# EAGLE board SparkFun_Robo_HAT (EAGLE 9.5.2)
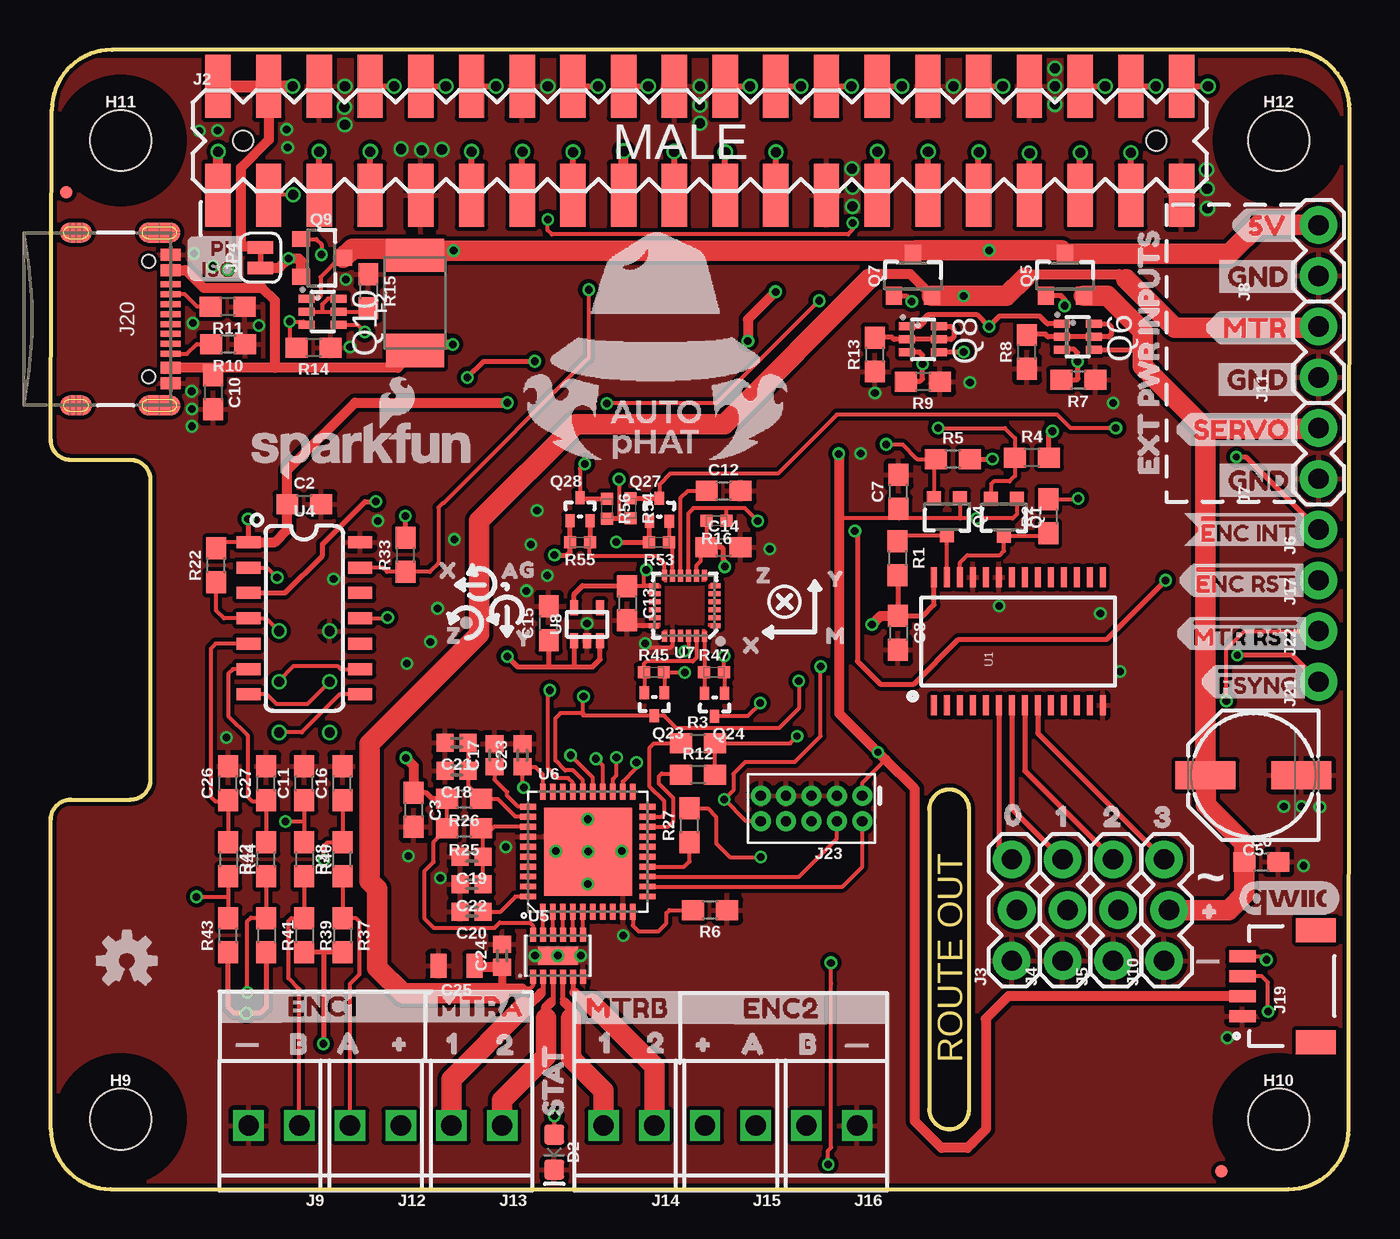
[diagram p3: board, top side]
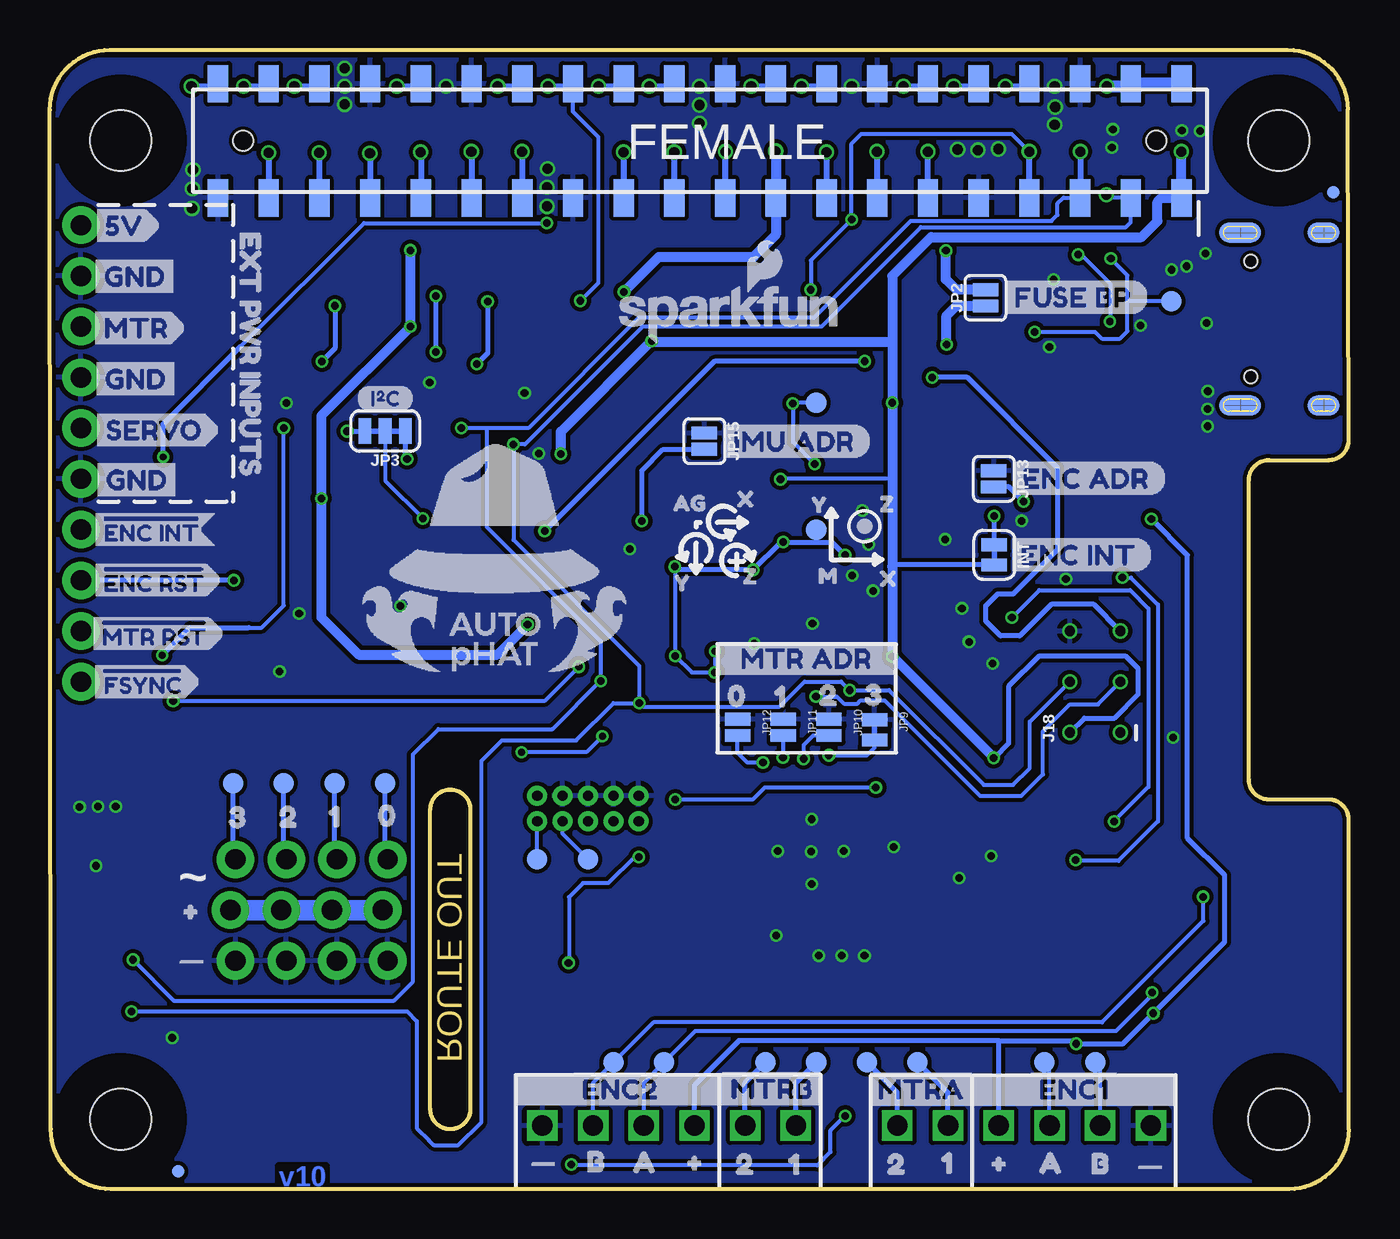
[diagram p4: board, bottom side, seen from below]

Size 65.05 x 57.03 mm. Coordinates in mm from the lower left corner, seen from the top.
Outline: 3,0 62,0 arc90 65,3 65.05,54.03 arc90 62.05,57.03 3.05,57.03 arc90 0.05,54.03 0,37.5 arc90 1,36.5 4,36.5 arc-90 5,35.5 5,20.5 arc-90 4,19.5 1,19.5 arc90 0,18.5 0,3 arc90 3,0
Outline: 45,3 arc90 46,4 46,19 arc90 45,20 arc90 44,19 44,4 arc90 45,3
Copper layers (1*16): Top 0.035mm / dielectric 1.5mm / Bottom 0.035mm
Design rules "SparkFun-2-layer-FAB-LIMIT": minimum track width 4mil, minimum drill 6mil, track to track 4mil, track to pad 4mil, pad to pad 4mil, via to via 4mil, smd to smd 4mil, copper to edge 4mil, drill to drill 4mil, minimum pad ring 5mil, minimum via ring 5mil, stop-mask expansion 4mil, vias tented up to drill 25mil, thermal gap 10mil
Net classes: 1 power: width 0.508 mm
tRestrict: area 29.3,16.8 to 29.4,16.9; area 26.8,19.3 to 27,19.4; area 24.4,16.8 to 24.5,17; area 26.8,14.4 to 27,14.5; area 0.4,0.4 to 6.6,6.6; area 0.4,49.4 to 6.6,55.6; area 58.4,0.4 to 64.6,6.6; area 58.4,49.4 to 64.6,55.6
bRestrict: area 0.4,0.4 to 6.6,6.6; area 0.4,49.4 to 6.6,55.6; area 58.4,0.4 to 64.6,6.6; area 58.4,49.4 to 64.6,55.6

## Footprints (pad centres in the part's own frame; a part is rotated, then mirrored left to right if it is on the bottom)
0603 = smd 1.1 x 1: 1 -0.85,0; 2 0.85,0
PANASONIC_D = smd 3 x 1.4: + 2.4,0; - -2.4,0
0402 = smd 0.85 x 0.9: 1 -0.58,0; 2 0.58,0
0805 = smd 0.8 x 1.2: 1 -0.9,0; 2 0.9,0
LED-0603@1 = smd 1 x 1: A -0.877,0; C 0.877,0
1812 = smd 1.676 x 2.896: 1 -2.388,0; 2 2.388,0
FIDUCIAL-MICRO = smd 0.635 x 0.635: 1 0,0
STAND-OFF-TIGHT = hole 3.048: 0,0
SMT-JUMPER_2_NC_TRACE_SILK = smd 0.635 x 1.27: 1 -0.508,0; 2 0.508,0
RASPBERRY_PI_HAT_40_PIN_SMD_STACKABLE_NOHOLES = smd 1.27 x 3.175: 1 0,-1.46; 2 0,4; 3 2.54,-1.46; 4 2.54,4; 5 5.08,-1.46; 6 5.08,4; 7 7.62,-1.46; 8 7.62,4; 9 10.16,-1.46; 10 10.16,4; 11 12.7,-1.46; 12 12.7,4; 13 15.24,-1.46; 14 15.24,4; 15 17.78,-1.46; 16 17.78,4; 17 20.32,-1.46; 18 20.32,4; 19 22.86,-1.46; 20 22.86,4; 21 25.4,-1.46; 22 25.4,4; 23 27.94,-1.46; 24 27.94,4; 25 30.48,-1.46; 26 30.48,4; 27 33.02,-1.46; 28 33.02,4; 29 35.56,-1.46; 30 35.56,4; 31 38.1,-1.46; 32 38.1,4; 33 40.64,-1.46; 34 40.64,4; 35 43.18,-1.46; 36 43.18,4; 37 45.72,-1.46; 38 45.72,4; 39 48.26,-1.46; 40 48.26,4 | smd 1.02 x 1.87 bottom: 1B 0,-1.587; 2B 0,4.128; 3B 2.54,-1.587; 4B 2.54,4.128; 5B 5.08,-1.587; 6B 5.08,4.128; 7B 7.62,-1.587; 8B 7.62,4.128; 9B 10.16,-1.587; 10B 10.16,4.128; 11B 12.7,-1.587; 12B 12.7,4.128; 13B 15.24,-1.587; 14B 15.24,4.128; 15B 17.78,-1.587; 16B 17.78,4.128; 17B 20.32,-1.587; 18B 20.32,4.128; 19B 22.86,-1.587; 20B 22.86,4.128; 21B 25.4,-1.587; 22B 25.4,4.128; 23B 27.94,-1.587; 24B 27.94,4.128; 25B 30.48,-1.587; 26B 30.48,4.128; 27B 33.02,-1.587; 28B 33.02,4.128; 29B 35.56,-1.587; 30B 35.56,4.128; 31B 38.1,-1.587; 32B 38.1,4.128; 33B 40.64,-1.587; 34B 40.64,4.128; 35B 43.18,-1.587; 36B 43.18,4.128; 37B 45.72,-1.587; 38B 45.72,4.128; 39B 48.26,-1.587; 40B 48.26,4.128 | hole 1: 1.27,1.27; 46.99,1.27
1X03_LOCK = drill 1.016 pad 1.88: 1 0,0.127; 2 2.54,-0.127; 3 5.08,0.127
1X01_NO_SILK = drill 1.016 pad 1.88: 1 0,0
1X02 = drill 1.016 pad 1.88: 1 0,0; 2 2.54,0
1X02_2.54_SCREWTERM = drill 1.016 square: P1 2.54,0; P2 0,0
2X3_TEST_POINTS = drill 0.508: 1 -2.54,-1.27; 2 -2.54,1.27; 3 0,-1.27; 4 0,1.27; 5 2.54,-1.27; 6 2.54,1.27
JST04_1MM_RA = smd 0.6 x 1.35: 1 -1.5,0; 2 -0.5,0; 3 0.5,0; 4 1.5,0 | smd 1.2 x 2: NC1 2.8,-3.675; NC2 -2.8,-3.675
USB-C-16P = smd 0.3 x 1: A5 -1.25,-0.34; A6 -0.25,-0.34; A7 0.25,-0.34; A8 1.25,-0.34; B5 1.75,-0.34; B6 0.75,-0.34; B7 -0.75,-0.34; B8 -1.75,-0.34 | smd 0.6 x 1: GND -3.225,-0.34; GND2 3.225,-0.34; VBUS1 -2.45,-0.34; VBUS2 2.45,-0.34 | smd 1 x 2.1: SHLD1 -4.32,-0.915; SHLD2 4.32,-0.915 | smd 1 x 2.1 bottom: SHLD3 -4.32,-0.915; SHLD4 4.32,-0.915 | smd 1 x 1.6: SHLD5 -4.32,-5.095; SHLD8 4.32,-5.095 | smd 1 x 1.6 bottom: SHLD6 -4.32,-5.095; SHLD7 4.32,-5.095 | hole 0.65: -2.89,-1.445; 2.89,-1.445
2X5-PTH-1.27MM = drill 0.508 pad 1: 1 -2.54,-0.635; 2 -2.54,0.635; 3 -1.27,-0.635; 4 -1.27,0.635; 5 0,-0.635; 6 0,0.635; 7 1.27,-0.635; 8 1.27,0.635; 9 2.54,-0.635; 10 2.54,0.635
SMT-JUMPER_2_NO_SILK = smd 0.635 x 1.27: 1 -0.406,0; 2 0.406,0
SMT-JUMPER_3_2-NC_TRACE_SILK = smd 0.635 x 1.27: 1 -1.016,0; 2 0,0; 3 1.016,0
SMT-JUMPER_2_NC_TRACE_NO-SILK = smd 0.635 x 1.27: 1 -0.508,0; 2 0.508,0
SMT-JUMPER_2_NO_NO-SILK = smd 0.635 x 1.27: 1 -0.406,0; 2 0.406,0
SOT323 = smd 0.7 x 0.7: 1 -0.65,-0.925; 2 0.65,-0.925; 3 0,0.925
SOT23-3 = smd 0.8 x 0.9: 1 -0.95,-1; 2 0.95,-1; 3 0,1.1
SOT363_PHILIPS = smd 0.4 x 0.8: 1 -0.65,-0.8; 2 0,-0.8; 3 0.65,-0.8; 4 0.65,0.8; 5 0,0.8; 6 -0.65,0.8
SOT-416FL = smd 0.46 x 0.65: 1 -0.5,-1.1; 2 0.5,-1.1; 3 0,0.05
0603@1 = smd 1.1 x 1: 1 -0.85,0; 2 0.85,0
0402-TIGHT = smd 0.6 x 0.6: 1 -0.5,0; 2 0.5,0
PAD.03X.04 = smd 1.016 x 1.016: P$1 0,0
TP_15TH = drill 0.381 pad 0.61: P$1 0,0
TSSOP-28_4MM = smd 1 x 0.3: 1 -3.2,4.225; 2 -3.2,3.575; 3 -3.2,2.925; 4 -3.2,2.275; 5 -3.2,1.625; 6 -3.2,0.975; 7 -3.2,0.325; 8 -3.2,-0.325; 9 -3.2,-0.975; 10 -3.2,-1.625; 11 -3.2,-2.275; 12 -3.2,-2.925; 13 -3.2,-3.575; 14 -3.2,-4.225; 15 3.2,-4.225; 16 3.2,-3.575; 17 3.2,-2.925; 18 3.2,-2.275; 19 3.2,-1.625; 20 3.2,-0.975; 21 3.2,-0.325; 22 3.2,0.325; 23 3.2,0.975; 24 3.2,1.625; 25 3.2,2.275; 26 3.2,2.925; 27 3.2,3.575; 28 3.2,4.225
SO14 = smd 0.6 x 1.2: 1 -3.175,-2.8; 2 -1.905,-2.8; 3 -0.635,-2.8; 4 0.635,-2.8; 5 1.905,-2.8; 6 3.175,-2.8; 7 4.445,-2.8; 8 4.445,2.8; 9 3.175,2.8; 10 1.905,2.8; 11 0.635,2.8; 12 -0.635,2.8; 13 -1.905,2.8; 14 -3.175,2.8
WSON-12 = smd 0.3 x 0.7: 1 -1.25,-1.05; 2 -0.75,-1.05; 3 -0.25,-1.05; 4 0.25,-1.05; 5 0.75,-1.05; 6 1.25,-1.05; 7 1.25,1.05; 8 0.75,1.05; 9 0.25,1.05; 10 -0.25,1.05; 11 -0.75,1.05; 12 -1.25,1.05 | smd 2 x 0.9: PAD 0,0
QFN-40 = smd 0.285 x 0.8: 1 -2.25,-3; 2 -1.75,-3; 3 -1.25,-3; 4 -0.75,-3; 5 -0.25,-3; 6 0.25,-3; 7 0.75,-3; 8 1.25,-3; 9 1.75,-3; 10 2.25,-3; 21 2.25,3; 22 1.75,3; 23 1.25,3; 24 0.75,3; 25 0.25,3; 26 -0.25,3; 27 -0.75,3; 28 -1.25,3; 29 -1.75,3; 30 -2.25,3 | smd 0.8 x 0.285: 11 3,-2.25; 12 3,-1.75; 13 3,-1.25; 14 3,-0.75; 15 3,-0.25; 16 3,0.25; 17 3,0.75; 18 3,1.25; 19 3,1.75; 20 3,2.25; 31 -3,2.25; 32 -3,1.75; 33 -3,1.25; 34 -3,0.75; 35 -3,0.25; 36 -3,-0.25; 37 -3,-0.75; 38 -3,-1.25; 39 -3,-1.75; 40 -3,-2.25 | smd 4.4 x 4.4: EP 0,0
QFN24-3X3 = smd 0.495 x 0.25: 1 -1.552,1; 6 -1.552,-1; 13 1.552,-1; 18 1.552,1 | smd 0.6 x 0.25: 2 -1.5,0.6; 3 -1.5,0.2; 4 -1.5,-0.2; 5 -1.5,-0.6; 14 1.5,-0.6; 15 1.5,-0.2; 16 1.5,0.2; 17 1.5,0.6 | smd 0.25 x 0.495: 7 -1,-1.552; 12 1,-1.552; 19 1,1.552; 24 -1,1.552 | smd 0.25 x 0.6: 8 -0.6,-1.5; 9 -0.2,-1.5; 10 0.2,-1.5; 11 0.6,-1.5; 20 0.6,1.5; 21 0.2,1.5; 22 -0.2,1.5; 23 -0.6,1.5
SC70 = smd 0.4 x 0.75: 1 -0.65,-0.825; 2 0,-0.825; 3 0.65,-0.825; 4 0.65,0.825; 5 -0.65,0.825

## Placement (x,y rotation side)
C2  0.1uF  [0603]  12.7,34.29 0 top
C3  0.1uF  [0603]  18.18,18.98 270 top
C5  100uF  [PANASONIC_D]  60.23,20.72 180 top
C6  0.1uF  [0603]  60.63,16.38 0 top
C7  0.1uF  [0603]  42.46,34.92 90 top
C8  0.1uF  [0603]  42.44,27.85 270 top
C10  0.1uF  [0603]  8.13,39.89 270 top
C11  10nF  [0603]  12.7,20.32 90 top
C12  0.1uF  [0603]  33.7,34.96 0 top
C13  0.1uF  [0603]  28.87,29.33 270 top
C14  1.0uF  [0603]  33.69,32.14 0 top
C15  1.0uF  [0603]  24.94,28.34 90 top
C16  10nF  [0603]  14.61,20.32 90 top
C17  1.0uF  [0402]  22.23,21.72 90 top
C18  1.0uF  [0402]  20.32,20.95 180 top
C19  1.0uF  [0402]  21.08,16.64 180 top
C20  1.0uF  [0402]  21.08,13.89 180 top
C21  0.1uF  [0402]  20.32,22.35 180 top
C22  0.1uF  [0402]  21.08,15.27 180 top
C23  0.1uF  [0402]  23.62,21.72 90 top
C24  0.1uF  [0402]  22.61,11.68 90 top
C25  10uF  [0805]  20.32,11.18 180 top
C26  10nF  [0603]  8.89,20.32 90 top
C27  10nF  [0603]  10.79,20.32 90 top
D2  BLUE  [LED-0603@1]  25.22,1.85 270 top
F2  16V/2.5A(5A TRIP)  [1812]  18.24,44.37 90 top
FD5  FIDUCIALUFIDUCIAL  [FIDUCIAL-MICRO]  58.64,0.88 0 top
FD6  FIDUCIALUFIDUCIAL  [FIDUCIAL-MICRO]  58.64,0.88 0 bottom
FD7  FIDUCIALUFIDUCIAL  [FIDUCIAL-MICRO]  0.78,49.91 0 top
FD8  FIDUCIALUFIDUCIAL  [FIDUCIAL-MICRO]  0.78,49.91 0 bottom
FRAME1  FRAME-LETTERNO_PACKAGE  [DUMMY]  26.67,-20.32 0 top  (outside the outline)
FRAME2  FRAME-LEDGER  [CREATIVE_COMMONS]  24.13,-20.32 0 top  (outside the outline)
FRAME3  FRAME-LEDGER  [CREATIVE_COMMONS]  24.13,-20.32 0 top  (outside the outline)
H9  STAND-OFFTIGHT  [STAND-OFF-TIGHT]  3.5,3.5 0 top
H10  STAND-OFFTIGHT  [STAND-OFF-TIGHT]  61.5,3.5 0 top
H11  STAND-OFFTIGHT  [STAND-OFF-TIGHT]  3.5,52.5 0 top
H12  STAND-OFFTIGHT  [STAND-OFF-TIGHT]  61.5,52.5 0 top
INT  [SMT-JUMPER_2_NC_TRACE_SILK]  17.75,31.76 270 bottom
J2  RASPBERRYPI-40-PIN-GPIO_SMD_STACKABLE_NOHOLES  [RASPBERRY_PI_HAT_40_PIN_SMD_STACKABLE_NOHOLES]  8.37,51.22 0 top
J3  [1X03_LOCK]  48.26,11.43 90 top
J4  [1X03_LOCK]  50.8,11.43 90 top
J5  [1X03_LOCK]  53.34,11.43 90 top
J6  [1X01_NO_SILK]  63.5,33.02 90 top
J7  EXT SERVO PWR  [1X02]  63.5,35.56 90 top
J8  EXT 5V PWR  [1X02]  63.5,45.72 90 top
J9  [1X02_2.54_SCREWTERM]  12.45,3.17 180 top
J10  [1X03_LOCK]  55.88,11.43 90 top
J11  EXT MTR PWR  [1X02]  63.5,40.64 90 top
J12  [1X02_2.54_SCREWTERM]  17.53,3.17 180 top
J13  [1X02_2.54_SCREWTERM]  22.61,3.17 180 top
J14  [1X02_2.54_SCREWTERM]  30.23,3.17 180 top
J15  [1X02_2.54_SCREWTERM]  35.31,3.17 180 top
J16  [1X02_2.54_SCREWTERM]  40.39,3.17 180 top
J17  [1X01_NO_SILK]  63.5,30.48 90 top
J18  ISP  [2X3_TEST_POINTS]  12.7,25.4 90 bottom
J19  [JST04_1MM_RA]  59.69,10.16 90 top
J20  USB C  [USB-C-16P]  6.35,43.56 270 top
J21  [1X01_NO_SILK]  63.5,25.4 90 top
J22  [1X01_NO_SILK]  63.5,27.94 90 top
J23  CORTEX_JTAG_DEBUG_PTH  [2X5-PTH-1.27MM]  38.1,19.05 180 top
JP2  FUSE BP  [SMT-JUMPER_2_NO_SILK]  18.19,44.62 90 bottom
JP3  I2C  [SMT-JUMPER_3_2-NC_TRACE_SILK]  48.26,37.95 180 bottom
JP4  PI ISO  [SMT-JUMPER_2_NC_TRACE_SILK]  10.51,46.63 90 top
JP9  JUMPER-PAD-2  [SMT-JUMPER_2_NC_TRACE_NO-SILK]  23.75,22.99 270 bottom
JP10  JUMPER-PAD-2  [SMT-JUMPER_2_NO_NO-SILK]  26.04,23.11 270 bottom
JP11  JUMPER-PAD-2  [SMT-JUMPER_2_NO_NO-SILK]  28.32,23.11 270 bottom
JP12  JUMPER-PAD-2  [SMT-JUMPER_2_NO_NO-SILK]  30.61,23.11 270 bottom
JP13  ADR  [SMT-JUMPER_2_NO_SILK]  17.78,35.56 270 bottom
JP15  ADR  [SMT-JUMPER_2_NO_SILK]  32.27,37.44 270 bottom
LOGO1  SFE_LOGO_NAME_FLAME.1_INCH  [SFE_LOGO_NAME_FLAME_.1]  30.99,43.81 0 bottom
LOGO2  OSHW-LOGOS  [OSHW-LOGO-S]  3.81,11.43 0 top
LOGO4  SFE_LOGO_NAME_FLAME.1_INCH  [SFE_LOGO_NAME_FLAME_.1]  15.6,36.98 0 top
Q1  310mA/60V/1.6Ω  [SOT323]  47.74,33.64 180 top
Q4  310mA/60V/1.6Ω  [SOT323]  44.89,33.66 180 top
Q5  20V/4.2A/52mΩ/1.4W  [SOT23-3]  50.8,45.72 0 top
Q6  [SOT363_PHILIPS]  51.44,42.67 270 top
Q7  20V/4.2A/52mΩ/1.4W  [SOT23-3]  43.18,45.72 0 top
Q8  [SOT363_PHILIPS]  43.69,42.55 270 top
Q9  20V/4.2A/52mΩ/1.4W  [SOT23-3]  13.55,46.62 270 top
Q10  [SOT363_PHILIPS]  13.62,43.93 270 top
Q23  20V/0.2A/8MHz/1.2Ω/1Vth  [SOT-416FL]  30.23,23.75 180 top
Q24  20V/0.2A/8MHz/1.2Ω/1Vth  [SOT-416FL]  33.25,23.72 180 top
Q27  20V/0.2A/8MHz/1.2Ω/1Vth  [SOT-416FL]  30.48,34.54 0 top
Q28  20V/0.2A/8MHz/1.2Ω/1Vth  [SOT-416FL]  26.51,34.55 0 top
R1  10k  [0603@1]  42.39,31.59 270 top
R2  10k  [0603@1]  49.96,33.68 90 top
R3  5.1k  [0603@1]  32.41,22.32 0 top
R4  10k  [0603@1]  49.14,36.62 0 top
R5  10k  [0603@1]  45.19,36.55 0 top
R6  5.1k  [0603@1]  33.02,13.97 180 top
R7  47k  [0603@1]  51.46,40.51 180 top
R8  10k  [0603@1]  48.9,41.91 90 top
R9  47k  [0603@1]  43.69,40.42 180 top
R10  5.1k  [0603@1]  8.88,42.3 180 top
R11  5.1k  [0603@1]  8.86,44.18 180 top
R12  5.1k  [0603@1]  32.42,20.75 0 top
R13  10k  [0603@1]  41.27,41.78 90 top
R14  47k  [0603@1]  13.16,42.13 180 top
R15  10k  [0603@1]  15.91,44.96 270 top
R16  2.2k  [0402-TIGHT]  33.35,33.45 180 top
R22  10k  [0603@1]  8.29,31.23 90 top
R25  1  [0603@1]  20.7,18.06 180 top
R26  1  [0603@1]  20.7,19.53 180 top
R27  470  [0603@1]  32,18.21 90 top
R33  10k  [0603@1]  17.78,31.75 90 top
R37  10k  [0603@1]  14.61,12.7 270 top
R38  10k  [0603@1]  14.61,16.51 90 top
R39  10k  [0603@1]  12.7,12.7 270 top
R40  10k  [0603@1]  12.7,16.51 270 top
R41  10k  [0603@1]  10.79,12.7 270 top
R42  10k  [0603@1]  10.79,16.51 90 top
R43  10k  [0603@1]  8.89,12.7 90 top
R44  10k  [0603@1]  8.89,16.51 270 top
R45  2.2k  [0402-TIGHT]  30.2,25.88 0 top
R47  2.2k  [0402-TIGHT]  33.22,25.88 0 top
R53  2.2k  [0402-TIGHT]  30.47,32.38 180 top
R54  2.2k  [0402-TIGHT]  29.04,34.09 270 top
R55  2.2k  [0402-TIGHT]  26.51,32.39 180 top
R56  2.2k  [0402-TIGHT]  27.85,34.07 270 top
TP0  [PAD.03X.04]  48.26,20.32 270 bottom
TP1  [PAD.03X.04]  50.8,20.32 270 bottom
TP2  [PAD.03X.04]  53.34,20.32 270 bottom
TP3  [PAD.03X.04]  55.88,20.32 270 bottom
TP4  [TP_15TH]  60.88,11.48 270 top
TP5  [TP_15TH]  60.96,8.89 270 top
TP6  [PAD.03X.04]  8.89,44.45 0 bottom
TP7  [PAD.03X.04]  40.64,16.51 180 bottom
TP8  [PAD.03X.04]  38.1,16.51 180 bottom
TP9  TEST-POINT3X4  [PAD.03X.04]  26.67,33.02 0 bottom
TP10  [PAD.03X.04]  26.67,39.37 0 bottom
TP11  [PAD.03X.04]  36.83,6.35 180 bottom
TP12  [PAD.03X.04]  34.29,6.35 180 bottom
TP13  [PAD.03X.04]  29.21,6.35 90 bottom
TP14  [PAD.03X.04]  26.67,6.35 90 bottom
TP15  [PAD.03X.04]  24.13,6.35 90 bottom
TP16  [PAD.03X.04]  21.59,6.35 90 bottom
TP17  [PAD.03X.04]  15.24,6.35 0 bottom
TP18  [PAD.03X.04]  12.7,6.35 0 bottom
TP19  [TP_15TH]  22.86,39.37 0 bottom
U1  PCA9685  [TSSOP-28_4MM]  48.46,27.42 90 top
U4  ATTINY84-ARDUINO  [SO14]  12.7,29.21 270 top
U5  DRV8835  [WSON-12]  25.4,11.68 0 top
U6  CY8C4245LQI-483  [QFN-40]  26.9,16.89 0 top
U7  9DoF IMU  [QFN24-3X3]  31.75,29.21 180 top
U8  1.8V/100mA  [SC70]  26.86,28.28 0 top
U$1  QWIIC_LOGO_5MM  [QWIIC_5MM]  62.01,14.58 0 top
U$2  [I_SUPER2_C-()-03]  49.68,39.59 0 bottom
U$3  [GND3]  58.04,45.69 0 top
U$4  [GND3]  58.01,40.54 0 top
U$5  [GND3]  58.06,35.48 0 top
U$6  [10]  18.89,7.29 0 top
U$7  [10]  26.53,7.33 0 top
U$8  [00]  46.85,18.73 0 top
U$9  [#MTR_RST5]  56.13,27.81 0 top
U$10  [#FSYNC7]  57.4,25.4 0 top
U$11  [#ENC_RST4]  56.26,30.48 0 top
U$12  [#ENC_INT6]  56.52,33.02 0 top
U$13  [EXT_PWR_INPUTS3]  54.99,34.85 90 top
U$14  [5V2]  59.05,48.26 0 top
U$15  [MTR1]  57.78,43.13 0 top
U$16  [SERVO0]  56.31,38.02 0 top
U$17  [11]  49.41,18.68 0 top
U$18  [#16]  31.39,7.37 0 top
U$19  [#16]  16.18,7.39 0 top
U$20  [B15]  11.02,7.26 0 top
U$21  [B15]  36.53,7.26 0 top
U$22  [ENC112]  10.94,9.16 0 top
U$23  [ENC213]  33.73,9.08 0 top
U$24  [22]  51.8,18.65 0 top
U$25  [33]  54.33,18.64 0 top
U$26  [A14]  13.41,7.32 0 top
U$27  [A14]  33.68,7.29 0 top
U$28  [_17]  8.33,7.95 0 top
U$29  [STAT4]  25.15,2.74 90 top
U$30  [_17]  38.86,7.92 0 top
U$31  [MTRA0]  18.42,9.16 0 top
U$32  [ISO1]  6.86,46.05 0 top
U$33  [05]  32,24.71 0 bottom
U$34  [16]  29.88,24.67 0 bottom
U$35  [PI0]  7.32,47.1 0 top
U$36  [27]  27.42,24.73 0 bottom
U$37  [38]  25.32,24.76 0 bottom
U$38  [_17]  59.46,12.12 0 bottom
U$39  [IMU_ADR9]  31.76,37.44 0 bottom
U$40  [MTRB1]  25.88,9.09 0 top
U$41  [#16]  59.28,14.02 0 bottom
U$43  [21]  21.39,7.23 0 top
U$44  [21]  28.94,7.33 0 top
U$46  [_17]  56.45,12.13 0 top
U$47  [#16]  56.75,14.03 0 top
U$48  [ENC_INT12]  17.36,31.76 0 bottom
U$49  [ENC_ADR11]  17.25,35.59 0 bottom
U$50  [FUSE_BP10]  17.71,44.66 0 bottom
U$51  [MTR_ADR0]  31.42,26.57 0 bottom
U$52  [EXT_PWR_INPUTS3]  55.01,48.84 270 bottom
U$53  [5V3]  63.21,48.25 0 bottom
U$54  [MTR4]  63.26,43.11 0 bottom
U$55  [SERVO5]  63.16,38 0 bottom
U$56  [#ENC_RST6]  63.44,30.49 0 bottom
U$57  [#MTR_RST7]  63.54,27.81 0 bottom
U$58  [#FSYNC8]  63.43,25.4 0 bottom
U$59  [GND3]  63.24,45.7 0 bottom
U$60  [GND3]  63.2,40.56 0 bottom
U$61  [GND3]  63.14,35.51 0 bottom
U$62  [#ENC_INT0]  63.43,33.02 0 bottom
U$63  [#16]  18.79,1.4 0 bottom
U$64  [#16]  34.03,1.44 0 bottom
U$65  [B15]  39.1,1.37 0 bottom
U$66  [B15]  13.83,1.28 0 bottom
U$67  [ENC112]  16.43,5 0 bottom
U$68  [ENC213]  39.33,5.01 0 bottom
U$69  [A14]  36.77,1.36 0 bottom
U$70  [A14]  16.42,1.32 0 bottom
U$71  [_17]  41.85,2 0 bottom
U$72  [_17]  11.45,1.83 0 bottom
U$73  [MTRA0]  24.51,5 0 bottom
U$74  [MTRB1]  31.89,5.02 0 bottom
U$75  [10]  28.97,1.25 0 bottom
U$76  [10]  21.32,1.32 0 bottom
U$77  [21]  31.61,1.25 0 bottom
U$78  [21]  24.02,1.25 0 bottom
U$79  [00]  49.52,18.71 0 bottom
U$80  [22]  54.47,18.64 0 bottom
U$81  [33]  57.01,18.63 0 bottom
U$82  [11]  52,18.66 0 bottom
U$83  [AUTOHAT-LOGO]  42.65,32.44 0 bottom
U$85  [AUTOHAT-LOGO]  30.43,43.05 0 top
U$103  [X0]  20.94,30.97 180 top
U$104  [Y1]  22.62,27.58 0 top
U$105  [Z2]  21.19,27.71 180 top
U$106  [G5]  22.78,31.01 0 top
U$107  [A4]  21.89,30.96 0 top
U$108  [M3]  38.14,27.71 0 top
U$109  [X0]  36.14,27.22 180 top
U$110  [Y1]  38.24,30.56 0 top
U$111  [Z2]  34.65,30.73 0 top
U$122  [M3]  27.25,30.71 0 bottom
U$123  [X0]  22,30.56 180 bottom
U$124  [Y1]  27.58,34.26 0 bottom
U$125  [Z2]  24.17,34.29 0 bottom
U$126  [X0]  31.29,34.54 0 bottom
U$127  [Y1]  34.44,30.35 0 bottom
U$128  [Z2]  31.04,30.68 0 bottom
U$129  [G5]  33.66,34.34 0 bottom
U$130  [A4]  34.52,34.34 0 bottom

## Tracks (layer width: path | path; a pad name or v marks a point on that pad's centre or on a via)
1.8V  (via drill 0.35, 0.38)
  Top 0.203: C13.1 28.9,30.21 U7.13 29.7,30.21 29.7,30.88 v29.82,31 | U7.8 32.35,31.24 32.56,31.45 32.56,31.86 | Q23.1 30.73,25.86 R45.2 30.72,25.87 v31.75,25.87 | Q24.1 33.75,25.86 R47.2 33.72,26.43 33.73,26.44 v33.73,26.7 | U7.22 31.95,27.12 v31.75,26.92 | R16.2 C14.1
  Top 0.254: U8.5 26.21,29.79 26.63,30.21 28.9,30.21 | 32.56,31.86 C14.1 33.58,32.14 33.69,32.03 33.69,31.51 33.75,31.45 v33.75,31.16 | v28.32,32.39 R53.2 Q27.1 | v25.23,31.74 25.86,31.74 26.01,31.89 R55.2 Q28.1
  Bottom 0.203: v33.75,31.16 33.75,26.72 v33.73,26.7 32.9,25.87 v31.75,25.87 | v31.75,25.87 | v31.75,26.92 v31.75,25.87 | TP9.P$1 26.67,32.39
  Bottom 0.254: v33.75,31.16 33.59,31 v29.82,31 28.44,32.39 v28.32,32.39 26.67,32.39 25.88,32.39 v25.23,31.74
3.3V  (via drill 0.35, 0.38, 0.51)
  Top 0.203: U5.12 24.15,13.19 24,13.34 22.48,13.34 22.23,13.08 19.18,13.08 18.73,13.52 18.73,15.94 19.18,16.38 19.18,17.39 R25.2 R26.2 | Q1.1 48.39,33.79 48.18,33.58 v46.37,33.58 45.55,33.58 | 45.55,33.58 42.48,33.58 | 42.48,33.58 39.5,33.58 | Q4.1 45.54,33.58 45.55,33.58 | C7.1 42.46,33.6 42.48,33.58 | v28.46,35.54 28.46,35 28.46,33.57 | U4.1 8.59,32.38 R22.2 | J23.1 40.64,20.34 41.8,21.5 | R12.2 33.26,20.77 R3.2 37.03,22.32 v37.38,22.67
  Top 0.254: v22.86,26.67 23.39,26.14 24.93,26.14 | 24.93,26.14 26.19,26.14 | 26.19,26.14 27.14,26.14 27.51,26.52 U8.3 | U8.1 26.21,26.17 26.19,26.14 | C15.1 24.94,26.15 24.93,26.14 | R26.2 19.1,19.53 18.8,19.83 C3.1 | R54.2 29.02,33.57 28.46,33.57 R56.2 | R43.1 8.89,9.09 9.18,8.8 v9.79,8.8 10.5,8.8 10.79,9.1 R41.2 | R39.2 R37.2 13.65,11.85 v13.65,7.28 | v9.88,33.55 9.88,32.4 U4.1
  Top 0.508: v17.78,21.59 18.18,21.19 C3.1 | J19.2 47.97,9.66 46.83,8.53 46.83,2.98 46.17,2.32 46.17,2.31 45.91,2.06 44.62,2.06 43.27,3.4 43.27,20.04 41.8,21.5 v41.43,21.88 39.5,23.81 39.5,33.58 39.5,36.77 v39.46,36.81 | TP19.P$1 15.24,39.37 11.85,35.98 C2.1 11.85,33.01 11.23,32.38 U4.1 | v36.3,44.92 34.91,43.54 v34.91,42.47 | J2.17 28.69,51.96 v28.7,51.97 | J2.1 v8.37,51.93 v8.38,51.94
  Bottom 0.203: 22.86,35.56 28.44,35.56 v28.46,35.54 | JP3.2 48.26,35.47 v46.37,33.58 | v37.38,22.67 38.18,21.88 v41.43,21.88
  Bottom 0.254: J15.P1 32.77,5.2 30.54,7.43 17.53,7.43 | 17.53,7.43 13.81,7.43 v13.65,7.28 11.32,7.28 v9.79,8.8 6.21,12.38 6.21,15.71 8.07,17.57 8.07,31.75 v9.88,33.55 | INT.2 22.78,31.25 22.86,31.17 | J18.2 13.25,23.58 11.72,23.58 10.54,24.77 10.54,26.05 11.16,26.68 15.52,26.68 17.03,25.17 17.03,22.31 17.75,21.59 v17.78,21.59 | J12.P2 17.53,7.43
  Bottom 0.508: v17.78,21.59 v22.86,26.67 22.86,31.17 22.86,35.56 TP19.P$1 22.86,42.43 | 22.86,42.43 22.86,45.72 20.92,47.66 10.38,47.66 9.58,48.46 9.58,49.43 9.38,49.63 J2.1B v8.37,51.93 v8.38,51.94 | 22.86,42.43 34.88,42.43 v34.91,42.47 39.46,37.92 v39.46,36.81 | v36.3,44.92 34.55,46.67 29.81,46.67 28.69,47.79 J2.17B 28.69,51.96 v28.7,51.97
5V  (via drill 0.38)
  Top 0.203: R2.2 51.41,34.53 v51.46,34.58 | Q9.3 14.47,46.62 13.51,45.66 13.51,44.7 13.39,44.58 Q10.1
  Top 0.254: Q8.1 43.54,43.2 43.74,43.39 43.74,43.57 43.96,43.79 46.38,43.79 v46.99,43.18 47.52,43.71 49.53,43.71 49.92,43.32 Q6.1 | U1.28 44.23,29.25 43.67,28.69 43.56,28.69 43.55,28.7 C8.1 42.44,30.69 R1.2
  Top 0.508: v41.13,28.26 41.56,28.7 C8.1
  Top 1.016: 43.34,46.98 v20.18,46.98 18.47,46.98 F2.2 17.93,47.07 15.11,47.07 Q9.3 | Q7.3 43.34,46.98 | 43.34,46.98 43.36,47 v46.99,47 50.62,47 Q5.3 59.04,46.82 60.5,48.28 63.48,48.28 J8.2
  Bottom 0.508: v46.99,47 v46.99,43.18 51.46,38.71 v51.46,34.58 51.46,28.63 49.59,26.75 42.63,26.75 v41.13,28.26 | JP2.2 19.66,45.03 20.18,45.55 v20.18,46.98
!ENC_INT  (via drill 0.35, 0.38, 0.51)
  Top 0.203: v26.94,45.03 26.94,41.61 19.68,34.35 19.63,34.35 19.42,34.13 19.42,31.34 18.98,30.9 R33.1 16.84,30.9 16.63,31.11 U4.13 | v40.16,48.36 40.16,48.04 39.93,47.8 25.09,47.8 24.89,48.01 v24.89,48.53 v24.9,48.54
  Top 0.254: J6.1 59.87,36.65 v59.38,36.65
  Top 0.305: v16,51.94 v15.99,51.93 J2.7
  Bottom 0.203: v26.94,45.03 26.94,46.5 v24.9,48.54 24.9,52.34 24.41,52.83 16.89,52.83 v16,51.94 | 55.47,42.21 49.32,48.36 v40.16,48.36
  Bottom 0.254: v59.38,36.65 59.38,38.3 55.47,42.21
  Bottom 0.305: J2.7B v15.99,51.93 v16,51.94
!ENC_RST  (via drill 0.38)
  Top 0.203: J18.5 10.79,28.57 U4.4 8.67,28.57 8.29,28.96 R22.1
  Top 0.254: v20.86,40.64 21.67,41.45 v24.24,41.45 | v40.27,32.94 40.39,32.82 40.39,26.43 41.54,25.28 43.22,25.28 45.47,27.53 52.89,27.53 v55.84,30.48
  Bottom 0.254: J18.5 12.77,29.28 14.9,29.28 16.48,27.7 17.43,27.7 18.17,28.44 18.17,29.2 17.58,29.8 16.8,29.8 14.57,32.03 14.57,36.1 19.11,40.64 v20.86,40.64 | v24.24,41.45 31.77,41.45 v40.27,32.94 | v55.84,30.48 J17.1
!FSYNC_1.8V
  Top 0.203: U7.11 31.15,32.2 R53.1 Q27.2
!FSYNC_3.3V  (via drill 0.35, 0.38)
  Top 0.203: v53.34,38.1 51.08,38.1 50.41,38.77 39.37,38.77 36.41,35.81 31.02,35.81 30.48,35.27 Q27.3
  Top 0.254: R54.1 Q27.3 | J21.1 62.18,26.72 v59.44,26.72
  Bottom 0.203: v53.34,38.1 53.34,29.21 54.44,28.11 55.09,28.11
  Bottom 0.254: v59.44,26.72 58.05,28.11 55.09,28.11
!MTR_RST  (via drill 0.38)
  Top 0.203: U6.30 24.65,20.75 24.26,21.14 C23.1 23.62,20.17 v23.68,20.11 | v38.56,26.15 38.56,22.68 37.25,21.37 34.77,21.37 34.19,20.79 34.19,19.96 v33.73,19.51 34.82,18.41 J23.10 | v58.88,24.43 58.88,27.03 59.76,27.91 63.48,27.91 J22.1
  Bottom 0.203: v38.56,26.15 40.28,24.43 v58.88,24.43 | v23.68,20.11 29.25,20.11 29.85,19.51 v33.73,19.51
AD0/SDO  (via drill 0.38)
  Top 0.203: U7.9 31.95,33.85 32.19,34.09 33.86,34.09 | 33.86,34.09 34.77,34.09 v35.4,33.45 | R16.1 33.85,34.08 33.86,34.09
  Bottom 0.254: v35.4,33.45 35.4,35.97 34.33,37.04 JP15.2
ADR  (via drill 0.38)
  Top 0.254: U4.3 11.73,29.84 13.61,31.72 13.61,32.29 15.73,34.42 v16.28,34.42
  Bottom 0.254: v16.28,34.42 17.01,35.15 JP13.2
AOUT1
  Top 0.254: U5.2 24.65,9.92 24.54,9.81
  Top 0.508: 24.54,9.81 23.82,9.09 23.66,9.09
  Top 1.016: 23.66,9.09 20.07,5.5 J13.P1
  Bottom 0.254: J13.P1 20.07,4.83 TP16.P$1
AOUT2
  Top 0.254: U5.3 25.16,9.33 25.04,9.33
  Top 0.508: 24.82,8.55 24.82,9.1 25.04,9.33
  Top 1.016: J13.P2 22.61,4.43 24.82,6.64 24.82,8.55
  Bottom 0.254: J13.P2 22.61,4.83 TP15.P$1
BOUT1
  Top 0.254: U5.4 25.63,10.61 25.63,9.51 25.74,9.39 25.74,9.35
  Top 0.508: 26.07,8.55 26.07,9.03 25.74,9.35
  Top 1.016: J14.P1 27.69,4.92 26.07,6.54 26.07,8.55
  Bottom 0.254: J14.P1 27.69,5.33 TP14.P$1
BOUT2
  Top 0.254: U5.5 26.15,9.96 26.23,9.89 26.23,9.84
  Top 0.508: 27.11,9.27 26.8,9.27 26.23,9.84
  Top 1.016: 27.11,9.27 30.23,6.16 J14.P2
  Bottom 0.254: J14.P2 30.23,5.33 TP13.P$1
CC1
  Top 0.203: R11.2 7.33,44.18 6.7,44.81 J20.A5
CC2
  Top 0.203: J20.B5 6.82,41.81 7.31,42.3 R10.2
CE0  (via drill 0.51)
  Top 0.305: J2.24 v37.56,55.22 v37.57,55.22
  Bottom 0.305: v37.57,55.22 36.44,55.22 J2.24B
CH0
  Top 0.254: U1.6 47.48,17.16 J3.3
  Bottom 0.254: J3.3 48.26,16.64 TP0.P$1
CH1
  Top 0.254: U1.7 48.13,19.05 J4.3
  Bottom 0.254: J4.3 50.8,16.64 TP1.P$1
CH2
  Top 0.254: U1.8 48.78,20.94 J5.3
  Bottom 0.254: J5.3 53.34,16.64 TP2.P$1
CH3
  Top 0.254: U1.9 49.44,22.83 J10.3
  Bottom 0.254: J10.3 55.88,16.64 TP3.P$1
CONFIG_OUT
  Top 0.203: U6.10 29.15,13.19 29.44,12.9 30.43,12.9 30.84,13.31 30.84,13.82 30.99,13.97 R6.2
ENC1A_FILTERED  (via drill 0.38)
  Top 0.203: C16.1 R38.2 13.86,17.36 13.68,17.18 v13.68,16.48 | U4.2 10.84,31.11 v11.34,30.61
  Bottom 0.203: v11.34,30.61 10.91,30.61 9.55,29.26 9.55,18.41 11.53,16.43 13.63,16.43 v13.68,16.48
ENC1A_RAW
  Top 0.203: J12.P1 14.99,10.27 15.46,10.75 15.46,13.39 15.3,13.55 R37.1 R38.1
  Bottom 0.203: J12.P1 14.99,6.1 TP17.P$1
ENC1B_FILTERED  (via drill 0.38)
  Top 0.203: C11.1 12.7,18.41 | 12.7,18.41 R40.1 | U4.11 16.83,28.57 v16.87,28.61 | v11.75,18.41 12.7,18.41
  Bottom 0.203: v16.87,28.61 15.49,29.98 10.95,29.98 10.02,29.06 10.02,20.13 v11.75,18.41
ENC1B_RAW
  Top 0.203: J9.P2 12.45,10.01 11.9,10.55 11.9,13.43 12.04,13.56 12.69,13.56 R39.1 R40.2
  Bottom 0.203: J9.P2 12.45,6.1 TP18.P$1
ENC2A_FILTERED
  Top 0.203: R42.2 C27.1 10.74,19.42 10.08,19.42 9.85,19.65 9.85,22.72 8.89,23.67 8.89,25.8 9.12,26.04 U4.6
ENC2A_RAW  (via drill 0.38)
  Top 0.203: R42.1 10.79,13.59 | 10.79,13.59 R41.1 | v9.84,9.85 9.84,13.4 10.03,13.59 10.79,13.59
  Bottom 0.203: v9.84,9.85 9.84,9.73 11.66,7.91 32.73,7.91 TP12.P$1 35.31,5.33 J15.P2
ENC2B_FILTERED
  Top 0.203: R44.1 C26.1 8.84,19.42 8.24,19.42 8.02,19.64 8.02,27.06 8.26,27.3 U4.5
ENC2B_RAW  (via drill 0.38)
  Top 0.203: R44.2 8.89,14.63 | 8.89,14.63 R43.2 | v7.3,14.63 8.89,14.63
  Bottom 0.203: v7.3,14.63 7.28,14.61 7.28,13.43 12.36,8.35 34.83,8.35 TP11.P$1 37.85,5.33 J16.P1
GND  (via drill 0.38, 0.51)
  Top 0.203: 26.17,17.64 v26.92,16.89 28.65,15.17 | U7.20 31.15,27.22 31.03,27.09 30.02,27.09 29.86,27.26
  Top 0.254: U7.18 29.14,28.21 C13.2
  other vias: 25.4,11.68 24.26,11.68 26.54,11.68 19.51,15.58 17.9,16.68 10.42,43.23 7.12,43.35 14.99,42.17 14.78,45.54 8.12,46.2 8.86,46.03 7.16,46.84 26.86,28.32 46.03,40.39 41.28,39.86 53.2,39.36 47.51,29.19 52.57,28.82 53.55,25.92 23.83,29.95 8.8,22.6 7.06,39.06 7.07,38.19 7.06,39.94 40.56,36.83 22.79,17.13 28.67,12.69 16.38,33.46 14.16,30.54 29.78,27.31 62.65,19.15 62.75,16.19 58.93,7.57 14.73,55.22 24.89,55.22 32.51,55.22 45.21,55.22 50.29,55.22 57.91,50.09 18.57,52.02 40.16,49.2 8.36,53.01 7.44,52.98 11.81,53.06 11.86,52.14 17.55,52.07 19.58,52.04 14.71,54.18 14.73,53.29 32.51,54.28 32.51,53.37 40.16,50.16 40.13,51.08 57.89,51.03 57.94,49.1 50.29,54.31 50.29,56.11 63.56,19.12 61.76,19.15 17.83,26.31 19.02,27.4 19.38,29.08 24.35,33.98 24.05,32.28 24.86,30.73 20.21,32.53 36.01,32.05 25.3,16.92 28.6,16.92 26.9,15.27 26.9,18.52
  pour Top (isolate 0.203, rank 2): 0,56.54 65,56.54 65,0 0,0
  pour Bottom (isolate 0.203, rank 2): 0,56.54 65,56.54 65,0 0,0
  pour Top (isolate 0.305): 62,0 arc90 65,3 65,53.5 arc90 62,56.5 3,56.5 arc90 0,53.5 0,3 arc90 3,0
  pour Bottom (isolate 0.305): 3,0 arc-90 0,3 0,53.5 arc-90 3,56.5 62,56.5 arc-90 65,53.5 65,3 arc-90 62,0
GP5  (via drill 0.51)
  Top 0.305: J2.29 v43.93,51.93 v43.94,51.94
  Bottom 0.305: v43.94,51.94 43.94,49.64 J2.29B
GP6  (via drill 0.51)
  Top 0.305: J2.31 46.47,51.91 v46.48,51.92
  Bottom 0.305: v46.48,51.92 46.47,51.91 J2.31B
GP12  (via drill 0.51)
  Top 0.305: J2.32 v47.67,55.22 v47.68,55.22
  Bottom 0.305: v47.68,55.22 46.6,55.22 J2.32B
GP13  (via drill 0.51)
  Top 0.305: J2.33 49.01,51.86 v49.02,51.87
  Bottom 0.305: v49.02,51.87 49.02,49.64 J2.33B
GP16  (via drill 0.51)
  Top 0.305: J2.36 v52.8,55.22 v52.81,55.22
  Bottom 0.305: v52.81,55.22 51.68,55.22 J2.36B
GP17  (via drill 0.51)
  Top 0.305: J2.11 v21.07,51.93 v21.08,51.94
  Bottom 0.305: J2.11B v21.07,51.93 v21.08,51.94
GP18  (via drill 0.51)
  Top 0.305: J2.12 v22.3,55.22
  Bottom 0.305: v22.3,55.22 21.2,55.22 J2.12B
GP19  (via drill 0.51)
  Top 0.305: J2.35 v51.55,51.88 v51.56,51.89
  Bottom 0.305: v51.56,51.89 51.56,49.64 J2.35B
GP20  (via drill 0.51)
  Top 0.305: J2.38 v55.34,55.22 v55.35,55.22
  Bottom 0.305: v55.35,55.22 54.22,55.22 J2.38B
GP21  (via drill 0.51)
  Top 0.305: J2.40 v57.96,55.22
  Bottom 0.305: v57.96,55.22 56.76,55.22 J2.40B
GP22  (via drill 0.51)
  Top 0.305: J2.15 26.15,51.91 v26.16,51.92
  Bottom 0.305: v26.16,51.92 26.16,49.64 J2.15B
GP23  (via drill 0.51)
  Top 0.305: J2.16 v27.4,55.22 v27.41,55.22
  Bottom 0.305: v27.41,55.22 26.28,55.22 J2.16B
GP24  (via drill 0.51)
  Top 0.305: J2.18 v29.92,55.22
  Bottom 0.305: v29.92,55.22 28.82,55.22 J2.18B
GP25  (via drill 0.51)
  Top 0.305: J2.22 v35.02,55.22 v35.03,55.22
  Bottom 0.305: v35.03,55.22 33.9,55.22 J2.22B
GP26  (via drill 0.51)
  Top 0.305: J2.37 v54.09,51.88 v54.1,51.89
  Bottom 0.305: v54.1,51.89 54.1,49.64 J2.37B
GP27  (via drill 0.51)
  Top 0.305: J2.13 v23.61,51.93 v23.62,51.94
  Bottom 0.305: J2.13B v23.61,51.93 v23.62,51.94
ID_SC  (via drill 0.51)
  Top 0.305: J2.28 v42.62,55.22
  Bottom 0.305: v42.62,55.22 41.52,55.22 J2.28B
ID_SD  (via drill 0.51)
  Top 0.305: J2.27 v41.39,51.93 v41.4,51.94
  Bottom 0.305: v41.4,51.94 41.4,49.64 J2.27B
IMU_INT_3.3V  (via drill 0.38, 0.51)
  Top 0.203: v38.48,44.47 33.34,39.33 v27.85,39.33 | v26.75,36.31 26.51,36.06 Q28.3
  Top 0.254: Q28.3 26.54,34.57 R56.1
  Top 0.305: J2.26 v40.1,55.22 v40.11,55.22
  Bottom 0.203: v38.48,44.47 37.58,45.37 37.58,52.67 38.85,53.94 J2.26B | v26.75,36.31 27.85,37.4 v27.85,39.33 27.85,39.37 TP10.P$1
  Bottom 0.305: v40.11,55.22 38.98,55.22 J2.26B
INT_1.8V
  Top 0.203: U7.12 30.75,31.3 30.36,31.69 27.09,31.69 26.99,31.78 26.99,32.38
  Top 0.254: 26.99,32.38 R55.1 Q28.2
INT_R  (via drill 0.38)
  Top 0.254: R33.2 17.78,33.68 v17.76,33.7
  Bottom 0.254: v17.76,33.7 17.76,32.27 INT.1
MISO
  Top 0.203: U4.8 14.47,24.77 12.56,22.86 J18.1
MODEB0  (via drill 0.38)
  Top 0.203: v29.34,21.35 29.34,21.08 28.65,20.39 U6.22
  Bottom 0.203: v29.34,21.35 30.12,21.35 30.61,21.84 JP12.2
MODEB1  (via drill 0.38)
  Top 0.203: v28.33,21.6 28.33,20.71 28.15,20.52 U6.23
  Bottom 0.203: v28.33,21.6 28.32,21.61 JP11.2
MODEB2  (via drill 0.38)
  Top 0.203: v27.3,21.55 27.65,21.2 U6.24
  Bottom 0.203: v27.3,21.55 27.3,22.23 26.82,22.71 JP10.2
MODEB3  (via drill 0.38)
  Top 0.203: v26.04,21.72 27.15,20.6 U6.25
  Bottom 0.203: v26.04,21.72 24.13,21.72 23.75,22.1 JP9.2
N$1  (via drill 0.38)
  Top 0.254: Q5.1 49.87,44.73 50.59,44.73 50.77,44.55 v50.77,44.22 | Q6.3 50.65,42.03 51.26,42.03 51.42,41.87 v51.42,41.44 51.45,41.41 51.45,40.58 51.38,40.51 R7.2
  Bottom 0.254: v50.77,44.22 50.77,42.09 v51.42,41.44
N$2  (via drill 0.38)
  Top 0.254: R4.2 49.99,37.77 v50.16,37.94
  Bottom 0.254: v50.16,37.94 JP3.3
N$3
  Top 0.203: U1.26 45.53,31.35 45.92,31.73 47.53,31.73 47.74,31.95 Q1.3 | Q1.3 | Q1.3 49.85,32.72 R2.1
N$4
  Top 0.203: U1.27 Q4.3 42.63,32.74 42.63,32.68 R1.1
N$5  (via drill 0.38)
  Top 0.254: R5.2 v47.16,36.55 v47.16,36.56
  Bottom 0.254: v47.16,36.56 47.24,36.64 JP3.1
N$11
  Top 0.254: R8.2 48.94,42.81 49.81,42.81 49.95,42.67 Q6.2 Q6.5 52.99,42.67 53.11,42.8 53.11,43.16 52.95,43.32 Q6.6
N$15  (via drill 0.38)
  Top 0.254: Q7.1 42.85,44.72 v43.13,44.44 | Q8.3 43.51,41.9 43.67,41.75 v43.67,41.31 43.67,40.56 43.55,40.45 42.87,40.45 R9.2
  Bottom 0.254: v43.13,44.44 43.13,41.85 v43.67,41.31
N$16
  Top 0.254: R13.2 41.3,42.65 42.13,42.65 42.24,42.55 Q8.2 Q8.5 45.1,42.55 45.23,42.67 45.23,43.05 45.09,43.2 Q8.6
N$18  (via drill 0.36, 0.38)
  Top 0.203: Q10.3 12.66,43.44 v11.96,43.44 11.96,42.45 12.14,42.28 12.16,42.28 R14.2 | Q9.1 13.29,47.57 13.56,47.3 v13.56,46.78
  Bottom 0.203: v13.56,46.78 13.39,46.78 11.94,45.33 11.94,43.46 v11.96,43.44 | v11.96,43.44
N$19
  Top 0.203: Q10.2 13.59,43.93 | 13.59,43.93 Q10.5 15.73,43.93 R15.2 | Q10.6 13.88,44.58 13.59,44.28 13.59,43.93
N$20  (via drill 0.51)
  Top 0.508: J2.4 10.91,52.53 9.53,51.15 9.53,47.17 10.47,47.17 JP4.2
  Top 0.61: J2.2 J2.4 v12.11,55.22 v12.12,55.22
  Bottom 0.61: v12.12,55.22 11.04,55.22 J2.4B J2.2B
N$24
  Top 0.203: C17.1 22.23,20.5 22.86,19.87 22.86,19.68 23.4,19.14 U6.31
N$25
  Top 0.203: C22.1 C19.1 21.66,17.71 21.34,18.03 | 21.34,18.03 22.1,18.03 22.2,18.14 U6.33 | R25.1 21.31,18.06 21.34,18.03
N$26
  Top 0.203: C20.1 22.53,13.89 23.28,14.64 U6.40
N$27  (via drill 0.38)
  Top 0.203: v25.22,3.66 D2.A | v38.93,1.23 38.93,1.93 39.08,2.07 39.08,10.3 v39.08,11.33 | R27.2 32.9,19.06 33.33,18.63 33.33,17.31 34.02,16.62 v35.55,16.62
  Bottom 0.203: v25.22,3.66 25.95,2.93 25.95,1.86 26.62,1.19 38.89,1.19 v38.93,1.23 | v39.08,11.33 39.05,11.35 39.05,14.62 38.36,15.31 37.09,15.31 35.78,16.62 v35.55,16.62
N$29
  Top 0.203: U7.10 31.55,34.6 31.91,34.96 C12.1
P2.0
  Top 0.203: U5.11 U6.1
P2.1
  Top 0.203: U5.10 U6.2
P2.2
  Top 0.203: U5.9 U6.3
P2.3
  Top 0.203: U5.8 U6.4
P2.4
  Top 0.203: U5.7 U6.5
P3.2
  Top 0.203: J23.2 40.64,16.14 39.64,15.14 U6.12
  Bottom 0.203: TP7.P$1 J23.2
P3.3
  Top 0.203: U6.13 37.46,15.64 39.37,17.55 J23.4
  Bottom 0.203: TP8.P$1 39.37,17.78 J23.4
PI-5V  (via drill 0.38)
  Top 0.203: Q10.4 15.36,43.28 v15.72,42.92
  Top 0.508: Q9.2 12.55,46.46 12.42,46.58 v11.91,46.58 11.45,46.12 JP4.1
  Bottom 0.203: v15.72,42.92 12.71,42.92 12.37,42.58 11.45,42.58 11.08,42.95 11.08,44.45 | v11.91,46.58 11.08,45.75 11.08,44.45 | TP6.P$1 11.08,44.45
PI_MISO  (via drill 0.51)
  Top 0.305: J2.21 33.77,51.91 v33.78,51.92
  Bottom 0.305: v33.78,51.92 33.78,49.64 J2.21B
PI_MOSI  (via drill 0.51)
  Top 0.305: J2.19 31.23,51.93 v31.22,51.94
  Bottom 0.305: v31.22,51.94 31.23,51.93 J2.19B
PI_RXI  (via drill 0.51)
  Top 0.305: J2.10 v19.78,55.22 v19.79,55.22
  Bottom 0.305: v19.79,55.22 18.66,55.22 J2.10B
PI_TXO  (via drill 0.51)
  Top 0.305: J2.8 v17.19,55.22 v17.2,55.22
  Bottom 0.305: v17.2,55.22 16.12,55.22 J2.8B
SCL_1.8V
  Top 0.203: Q23.2 29.73,25.86 R45.1 29.7,26.28 29.83,26.41 32.15,26.41 32.35,26.61 U7.23
SCL_3.3V  (via drill 0.38, 0.51)
  Top 0.203: U6.26 26.65,20.47 26.15,20.97 25.77,20.97 25.27,21.46 25.27,23.57 25.53,23.83 26.67,23.83 | v44.45,38.1 47.79,38.1 48.29,37.6 R4.1 48.29,35.71 48.02,35.43 47.23,35.43 47.09,35.3 Q1.2 | v37.46,25.44 37.46,24.07 36.48,23.08 31.34,23.08 30.72,23.7 Q23.3 26.67,23.7 26.67,23.83 | 26.67,23.83 26.67,24.64 v26.68,24.66 | J18.3 11.43,25.46 12.16,26.19 14.36,26.19 14.51,26.04 U4.9 | J19.4 60.7,11.66 TP4.P$1
  Top 0.305: J2.5 13.45,51.93 v13.44,51.94
  Bottom 0.203: 43.18,38.1 41.09,38.1 35.57,43.61 26.78,43.61 21.92,48.48 14.88,48.48 14.58,48.78 14.58,49.35 14.29,49.64 13.44,49.64 | 43.18,38.1 v44.45,38.1 | 43.18,38.1 43.18,33.16 37.46,27.44 v37.46,25.44 v37.47,25.44 39.88,23.03 45.6,23.03 46.86,21.76 46.86,10.39 47.82,9.44 58.84,9.44 TP4.P$1 | v26.68,24.66 25.64,24.66 25.28,24.3 24.61,24.3 24.45,24.46 23.24,24.46 18.46,19.68 16.4,19.68 15.32,20.77 15.32,22.92 13.96,24.27 12.56,24.27 J18.3
  Bottom 0.305: v13.44,51.94 13.44,49.64 J2.5B
SCL_OUT
  Top 0.178: 31.63,20.69 R12.1
  Top 0.203: U6.18 30.93,18.14 31.18,18.4 31.18,19.58 30.46,20.3 30.46,20.66 30.6,20.8 31.52,20.8 31.63,20.69
SCLK  (via drill 0.51)
  Top 0.305: J2.23 36.31,51.91 v36.32,51.92
  Bottom 0.305: v36.32,51.92 36.32,49.64 J2.23B
SDA_1.8V
  Top 0.203: R47.1 32.75,25.86 | 32.75,25.86 Q24.2 | U7.24 32.75,26.32 32.75,25.86
SDA_3.3V  (via drill 0.38, 0.51)
  Top 0.203: U6.27 26.15,20.33 25.91,20.57 25.4,20.57 24.89,21.08 24.89,24.87 v25,24.98 | v41.83,37.29 42.65,37.29 43.39,36.55 R5.1 44.24,36.45 Q4.2 | v35.53,24.33 35.53,24.31 34.9,23.67 Q24.3 | J18.4 12.85,24.28 11.31,24.28 10.82,24.77 U4.7 | TP5.P$1 60.96,10.34 60.64,10.66 J19.3 | v12.14,49.78 10.94,49.78 J2.3
  Bottom 0.203: v35.53,24.33 35.53,26.2 41.83,32.5 v41.83,37.29 41.26,37.29 35.37,43.17 26.41,43.17 21.43,48.16 11.15,48.16 10.91,48.4 J2.3B 11.99,49.63 v12.14,49.78 | v35.53,24.33 35.36,24.16 28.5,24.16 27.25,25.4 25.42,25.4 v25,24.98 23.02,24.98 18.28,20.24 16.81,20.24 15.97,21.07 15.97,23.4 J18.4 | TP5.P$1 47.16,8.89 46.68,8.41 46.68,3.05 46.06,2.43 45.83,2.19 44.6,2.19 43.44,3.35 43.44,21.44 42.41,22.47 38.69,22.47 36.83,24.33 v35.53,24.33
SDA_OUT
  Top 0.203: U6.19 30.59,18.64 30.73,18.77 30.73,19.41 30,20.14 30,22.11 30.21,22.32 R3.1
SERVO
  Top 0.254: Q6.4 54.46,42.02 54.7,41.78
  Top 1.016: Q5.2 52.92,44.72 54.7,42.94 54.7,41.78 54.7,41.2 57.83,38.07 | J10.2 59,13.97 59.78,14.75 C6.1 59.78,17.32 57.85,19.25 57.85,20.7 C5.+ 57.83,38.07 | J7.2 63.47,38.07 57.83,38.07
  Bottom 1.016: J10.2 J5.2 J4.2 J3.2
SLED
  Top 0.203: U6.14 31.73,16.14 32,16.41 R27.1
VBUS  (via drill 0.38)
  Top 0.508: J20.VBUS1 6.75,46.01 7.62,45.14 10.57,45.14 11.21,44.49 11.21,41.11 | 11.21,41.11 17.38,41.11 F2.1 18.56,42.29 v20.14,42.29 | 11.21,41.11 8.23,41.11 | 8.23,41.11 J20.VBUS2 | C10.1 8.13,41.01 8.23,41.11
  Bottom 0.508: v20.14,42.29 20.14,43.73 19.65,44.22 18.2,44.22 JP2.1
VDDD1
  Top 0.203: C21.1 C18.1 20.9,20.19 21.34,19.76 21.34,19.53 R26.1 22.38,19.53 23.27,18.64 U6.32
VIN-MTR  (via drill 0.38)
  Top 0.203: U5.1 24.15,10.18 24,10.03 23.62,10.03
  Top 0.254: Q8.4 44.5,41.91 v45.72,41.91
  Top 0.406: C24.1 22.61,10.16 22.61,10.03
  Top 0.508: C24.1 21.29,11.1 C25.1 | 23.62,10.03 22.61,10.03 | 22.61,10.16 22.24,9.79 22.44,9.79 | 48.78,45.64 48.95,45.8 53.51,45.8 53.75,45.55 53.87,45.55 | Q7.2 43.04,45.81 41.25,45.81 41.01,45.57
  Top 1.016: 22.44,9.79 17.64,9.79 16.35,11.08 16.35,15.03 15.97,15.42 15.97,22.29 21.46,27.79 21.46,33.46 26.3,38.3 33.74,38.3 41.01,45.57 | Q7.2 v45.72,44.72 47.87,44.72 48.78,45.64 | 53.87,45.55 56.29,43.13 63.45,43.13 J11.2
  Bottom 0.254: v45.72,41.91 v45.72,44.72

## Text on the board
Bottom: v10
Dimension: ROUTE OUT
tPlace: ~
bPlace: ~
tDocu: Pete Lewis | Servo Controller based on a design by Mike Hord / Serial Controlled Motor Driver based on designs by Marshall Taylor, Alex Wende / ICM-20948 based on a design by Owen Lyke / ATTINY84 Encoder based on a design by Nathan Seidle